# EAGLE design UIAPduino_Pro_Micro (EAGLE 9.6.2)
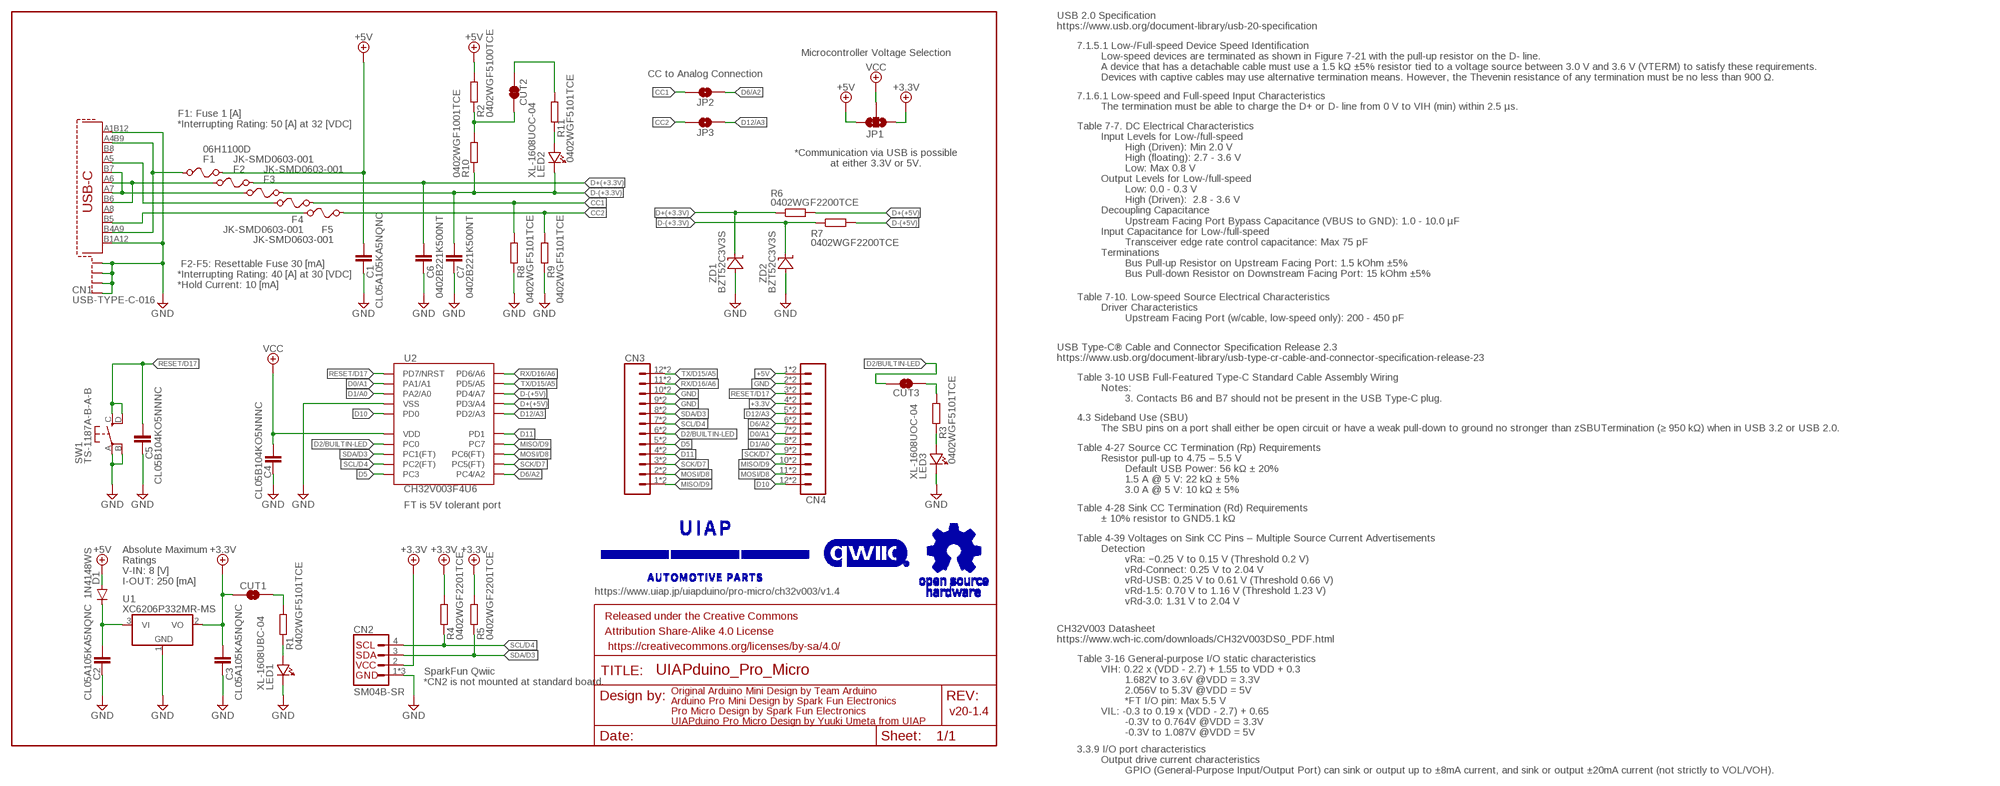
[diagram p0: schematic, sheet 1]

## Parts
C1  CL05A105KA5NQNC  C1005  [1005]
C2  CL05A105KA5NQNC  C1005  [1005]
C3  CL05A105KA5NQNC  C1005  [1005]
C4  CL05B104KO5NNNC  C1005  [1005]
C5  CL05B104KO5NNNC  C1005  [1005]
C6  0402B221K500NT  C1005  [1005]
C7  0402B221K500NT  C1005  [1005]
CN1  USB-TYPE-C-016  [USB-TYPE-C-016]
CN2  SM04B-SR  QWIIC_CONNECTORJS-1MM-GND  [JST04_1MM_RA]
CN3  CONN_12CASTLE_0.9MM  [1X12_CASTELLATED_0.9MM]
CN4  CONN_12CASTLE_0.9MM  [1X12_CASTELLATED_0.9MM]
CUT1  SMT-JP-2-NC  [SMT-JUMPER_2_NC_SILK_ROUND]
CUT2  SMT-JP-2-NC  [SMT-JUMPER_2_NC_SILK_ROUND]
CUT3  SMT-JP-2-NC  [SMT-JUMPER_2_NC_SILK_ROUND]
D1  1N4148WS  DIODE-SOD323-R  [SOD323-R]
F1  06H1100D  [1608]
F2  JK-SMD0603-001  06H1100D  [1608]
F3  JK-SMD0603-001  06H1100D  [1608]
F4  JK-SMD0603-001  06H1100D  [1608]
F5  JK-SMD0603-001  06H1100D  [1608]
FRAME1  FRAME-LETTER  [CREATIVE_COMMONS]
JP1  SMT-JP-3-NO-NC  [SMT-JUMPER_3_1-NC_TRACE_SILK]
JP2  SMT-JP-2-NO  [SMT-JUMPER_2_NO_SILK_ROUND]
JP3  SMT-JP-2-NO  [SMT-JUMPER_2_NO_SILK_ROUND]
LED1  XL-1608UBC-04  [1608-LED]
LED2  XL-1608UOC-04  [1608-LED]
LED3  XL-1608UOC-04  [1608-LED]
R1  0402WGF5101TCE  R1005  [1005]
R2  0402WGF5100TCE  R1005  [1005]
R3  0402WGF5101TCE  R1005  [1005]
R4  0402WGF2201TCE  R1005  [1005]
R5  0402WGF2201TCE  R1005  [1005]
R6  0402WGF2200TCE  R1005  [1005]
R7  0402WGF2200TCE  R1005  [1005]
R8  0402WGF5101TCE  R1005  [1005]
R9  0402WGF5101TCE  R1005  [1005]
R10  0402WGF1001TCE  R1005  [1005]
R11  0402WGF5101TCE  R1005  [1005]
SW1  TS-1187A-B-A-B  [TS-1187A-B-A-B]
U1  XC6206P332MR-MS  [SOT-23F_TOS]
U2  CH32V003F4U6  [QFN40P300X300X100-21T110]
ZD1  BZT52C3V3S  [SOD323-R]
ZD2  BZT52C3V3S  [SOD323-R]

## Nets
+3.3V [vcc]: C3.1 CN2.2 CN4.4 CN4.4B CUT1.2 JP1.1 R4.2 R5.2 U1.2(VO)
+5V [vcc]: C1.1 CN4.1 CN4.1B D1.A F1.2 JP1.3 R2.2
CC1: F4.2 JP2.1 R8.2
CC2: F5.2 JP3.1 R9.2
D0/A1: CN4.7 CN4.7B U2.2(PA1/A1)
D1/A0: CN4.8 CN4.8B U2.3(PA2/A0)
D2/BUILTIN-LED: CN3.6 CN3.6B CUT3.1 U2.7(PC0)
D5: CN3.5 CN3.5B U2.10(PC3)
D6/A2: CN4.6 CN4.6B JP2.2 U2.11(PC4/A2)
D10: CN4.12 CN4.12B U2.5(PD0)
D11: CN3.4 CN3.4B U2.15(PD1)
D12/A3: CN4.5 CN4.5B JP3.2 U2.16(PD2/A3)
D+(+3.3V): C6.1 F2.2 R6.1 ZD1.C
D+(+5V): R6.2 U2.17(PD3/A4)
D-(+3.3V): C7.1 F3.2 LED2.2(C) R7.1 R10.1 ZD2.C
D-(+5V): R7.2 U2.18(PD4/A7)
F1 [vcc]: CN1.A4B9(VBUS) CN1.B4A9(VBUS) F1.1
GND [GND]: C1.2 C2.2 C3.2 C4.2 C5.2 C6.2 C7.2 CN1.A1B12(GND) CN1.B1A12(GND) CN1.S1 CN1.S1B(S1) CN1.S2 CN1.S2B(S2) CN1.S3 CN1.S3B(S3) CN1.S4 CN1.S4B(S4) CN2.1 CN2.NC1 CN2.NC2 CN3.9 CN3.9B CN3.10 CN3.10B CN4.2 CN4.2B LED1.2(C) LED3.2(C) R8.1 R9.1 SW1.A(P) SW1.B(P1) U1.1(GND) U2.4(VSS) U2.21(VSS) ZD1.A ZD2.A
MISO/D9: CN3.1 CN3.1B CN4.10 CN4.10B U2.14(PC7)
MOSI/D8: CN3.2 CN3.2B CN4.11 CN4.11B U2.13(PC6(FT))
N$1: CN1.A6(DP1) CN1.B6(DP2) F2.1
N$2: CUT2.2 R2.1 R10.2
N$3: C2.1 D1.C U1.3(VI)
N$4: CN1.A7(DN1) CN1.B7(DN2) F3.1
N$5: CN1.A5(CC1) F4.1
N$6 [vcc]: CUT1.1 R1.2
N$7: LED3.1(A) R3.1
N$8: CN1.B5(CC2) F5.1
N$9: LED2.1(A) R11.1
N$10: CUT3.2 R3.2
N$11: CUT2.1 R11.2
N$38: LED1.1(A) R1.1
RESET/D17: C5.1 CN4.3 CN4.3B SW1.C(S) SW1.D(S1) U2.1(PD7/NRST)
RX/D16/A6: CN3.11 CN3.11B U2.20(PD6/A6)
SCK/D7: CN3.3 CN3.3B CN4.9 CN4.9B U2.12(PC5(FT))
SCL/D4: CN2.4 CN3.7 CN3.7B R4.1 U2.9(PC2(FT))
SDA/D3: CN2.3 CN3.8 CN3.8B R5.1 U2.8(PC1(FT))
TX/D15/A5: CN3.12 CN3.12B U2.19(PD5/A5)
VCC [vcc]: C4.1 JP1.2 U2.6(VDD)
Unconnected: CN1.A8(SBU1) CN1.B8(SBU2)

## Notes on the sheet
- USB 2.0 Specification
  https://www.usb.org/document-library/usb-20-specification
- 7.1.5.1 Low-/Full-speed Device Speed Identification
          Low-speed devices are terminated as shown in Figure 7-21 with the pull-up resistor on the D- line.
          A device that has a detachable cable must use a 1.5 kΩ ±5% resistor tied to a voltage source between 3.0 V and 3.6 V (VTERM) to satisfy these requirements.
          Devices with captive cables may use alternative termination means. However, the Thevenin resistance of any termination must be no less than 900 Ω.
- Microcontroller Voltage Selection
- CC to Analog Connection
- 7.1.6.1 Low-speed and Full-speed Input Characteristics
          The termination must be able to charge the D+ or D- line from 0 V to VIH (min) within 2.5 µs.
- Table 7-7. DC Electrical Characteristics
          Input Levels for Low-/full-speed
                  High (Driven): Min 2.0 V
                  High (floating): 2.7 - 3.6 V
                  Low: Max 0.8 V
          Output Levels for Low-/full-speed
                  Low: 0.0 - 0.3 V
                  High (Driven):  2.8 - 3.6 V
          Decoupling Capacitance
                  Upstream Facing Port Bypass Capacitance (VBUS to GND): 1.0 - 10.0 µF
          Input Capacitance for Low-/full-speed
                  Transceiver edge rate control capacitance: Max 75 pF
          Terminations
                  Bus Pull-up Resistor on Upstream Facing Port: 1.5 kOhm ±5%
                  Bus Pull-down Resistor on Downstream Facing Port: 15 kOhm ±5%
- F1: Fuse 1 [A]
  *Interrupting Rating: 50 [A] at 32 [VDC]
- *Communication via USB is possible
  at either 3.3V or 5V.
- F2-F5: Resettable Fuse 30 [mA]
  *Interrupting Rating: 40 [A] at 30 [VDC]
  *Hold Current: 10 [mA]
- Table 7-10. Low-speed Source Electrical Characteristics
          Driver Characteristics
                  Upstream Facing Port (w/cable, low-speed only): 200 - 450 pF
- USB Type-C® Cable and Connector Specification Release 2.3
  https://www.usb.org/document-library/usb-type-cr-cable-and-connector-specification-release-23
- Table 3-10 USB Full-Featured Type-C Standard Cable Assembly Wiring
          Notes:
                  3. Contacts B6 and B7 should not be present in the USB Type-C plug.
- 4.3 Sideband Use (SBU)
          The SBU pins on a port shall either be open circuit or have a weak pull-down to ground no stronger than zSBUTermination (≥ 950 kΩ) when in USB 3.2 or USB 2.0.
- Table 4-27 Source CC Termination (Rp) Requirements
          Resistor pull-up to 4.75 – 5.5 V
                  Default USB Power: 56 kΩ ± 20%
                  1.5 A @ 5 V: 22 kΩ ± 5%
                  3.0 A @ 5 V: 10 kΩ ± 5%
- Table 4-28 Sink CC Termination (Rd) Requirements
          ± 10% resistor to GND5.1 kΩ
- FT is 5V tolerant port
- Table 4-39 Voltages on Sink CC Pins – Multiple Source Current Advertisements
          Detection
                  vRa: −0.25 V to 0.15 V (Threshold 0.2 V)
                  vRd-Connect: 0.25 V to 2.04 V
                  vRd-USB: 0.25 V to 0.61 V (Threshold 0.66 V)
                  vRd-1.5: 0.70 V to 1.16 V (Threshold 1.23 V)
                  vRd-3.0: 1.31 V to 2.04 V
- Absolute Maximum
  Ratings
  V-IN: 8 [V]
  I-OUT: 250 [mA]
- https://www.uiap.jp/uiapduino/pro-micro/ch32v003/v1.4
- CH32V003 Datasheet
  https://www.wch-ic.com/downloads/CH32V003DS0_PDF.html
- Table 3-16 General-purpose I/O static characteristics
          VIH: 0.22 x (VDD - 2.7) + 1.55 to VDD + 0.3
                  1.682V to 3.6V @VDD = 3.3V
                  2.056V to 5.3V @VDD = 5V
                  *FT I/O pin: Max 5.5 V
          VIL: -0.3 to 0.19 x (VDD - 2.7) + 0.65
                  -0.3V to 0.764V @VDD = 3.3V
                  -0.3V to 1.087V @VDD = 5V
- SparkFun Qwiic
  *CN2 is not mounted at standard board.
- Original Arduino Mini Design by Team Arduino
- Arduino Pro Mini Design by Spark Fun Electronics
- Pro Micro Design by Spark Fun Electronics
- UIAPduino Pro Micro Design by Yuuki Umeta from UIAP | v20-1.4
- 3.3.9 I/O port characteristics
          Output drive current characteristics
                  GPIO (General-Purpose Input/Output Port) can sink or output up to ±8mA current, and sink or output ±20mA current (not strictly to VOL/VOH).

## Library data of the parts
C1-C7 = Mylib_e2:C
CN1 = Mylib_e2:USB-TYPE-C; JLCPCB-PART-#: C2927036; URL: https://jlcpcb.com/partdetail/DEALON-USB_TYPE_C016/C2927036
CN2 = SparkFun-Connectors:QWIIC_CONNECTOR: SparkFun I2C Standard Qwiic Connector An SMD 1mm pitch JST connector makes it easy and quick (get it? Qwiic?) to connect I2C devices to each other. The Qwiic system <http://www.sparkfun.com/qwiic> enables fast and solderless connection between popular platforms and various sensors and actuators. We carry 200mm <https://www.sparkfun.com/products/14204>, 100mm <https://www.sparkfun.com/products/14205>, 50mm <https://www.sparkfun.com/products/14206>, and breadboard friendly <https://www.sparkfun.com/products/14207> Qwiic cables. We also offer 10 pcs strips <https://www.sparkfun.com/products/14323> the SMD connectors.; PROD_ID: CONN-13694; VALUE: QWIIC_RIGHT_ANGLE
CN3 CN4 = Castellated:CONN_12: Multi connection point. Often used as Generic Header-pin footprint for 0.1 inch spaced/style header connections On any of the 0.1 inch spaced packages, you can populate with these: Break Away Headers - Straight <https://www.sparkfun.com/products/116> (PRT-00116) Break Away Male Headers - Right Angle <https://www.sparkfun.com/products/553> (PRT-00553) Female Headers <https://www.sparkfun.com/products/115> (PRT-00115) Break Away Headers - Machine Pin <https://www.sparkfun.com/products/117> (PRT-00117) Break Away Female Headers - Swiss Machine Pin <https://www.sparkfun.com/products/743> (PRT-00743) For SCREWTERMINALS and SPRING TERMINALS visit here: Screw Terimnals on SparkFun.com <https://www.sparkfun.com/search/results?term=Screw+Terminals> (5mm/3.5mm/2.54mm spacing) This device is also useful as a general connection point to wire up your design to another part of your project. Our various solder wires solder well into these plated through hole pads. Hook-Up Wire - Assortment (Stranded, 22 AWG) <https://www.sparkfun.com/products/11375> (PRT-11375) Hook-Up Wire - Assortment (Solid Core, 22 AWG) <https://www.sparkfun.com/products/11367> (PRT-11367) View the entire wire category on our website here <https://www.sparkfun.com/categories/141> Special notes: Molex polarized connector foot print use with SKU : PRT-08231 with associated crimp pins and housings. 1MM SMD Version SKU: PRT-10208 NOTES ON THE VARIANTS LOCK and LOCK_LONGPADS... This footprint was designed to help hold the alignment of a through-hole component (i.e. 6-pin header) while soldering it into place. You may notice that each hole has been shifted either up or down by 0.005 of an inch from it's more standard position (which is a perfectly straight line). This slight alteration caused the pins (the squares in the middle) to touch the edges of the holes. Because they are alternating, it causes a "brace" to hold the component in place. 0.005 has proven to be the perfect amount of "off-center" position when using our standard breakaway headers. Although looks a little odd when you look at the bare footprint, once you have a header in there, the alteration is very hard to notice. Also,if you push a header all the way into place, it is covered up entirely on the bottom side.
CUT1-CUT3 = Mylib_e2:SMT-JP-2-NC
D1 = diode:DIODE-: DIODE; JLCPCB-PART-#: C2128; URL: https://jlcpcb.com/partdetail/2485-1N4148WS/C2128
F1-F5 = Mylib_e2:06H1100D; JLCPCB-PART-#: C182303; URL: https://jlcpcb.com/partdetail/Shenzhen_lansonElec-06H1100D/C182303
FRAME1 = SparkFun-Aesthetics:FRAME-LETTER: Schematic Frame - Letter Standard 8.5x11 US Letter frame
JP1 = Mylib_e2:SMT-JP-3-NO-NC
JP2 JP3 = Mylib_e2:SMT-JP-2-NO
LED1 = Mylib_e2:XL-1608UBC-04; JLCPCB-PART-#: C965807; URL: https://jlcpcb.com/partdetail/C965807
LED2 LED3 = Mylib_e2:XL-1608UOC-04; JLCPCB-PART-#: C965801; URL: https://jlcpcb.com/partdetail/C965801
R1-R11 = Mylib_e2:R
SW1 = Mylib_e2:TS-1187A-B-A-B; JLCPCB-PART-#: C318884; URL: https://jlcpcb.com/partdetail/XKBConnection-TS_1187A_B_AB/C318884
U1 = Mylib_e2:XC6206P332MR-MS; JLCPCB-PART-#: C5252899; URL: https://jlcpcb.com/partdetail/C5252899
U2 = Mylib_e2:CH32V003F4U6: https://www.wch-ic.com/downloads/file/358.html
ZD1 ZD2 = Mylib_e2:BZT52C3V3S; JLCPCB-PART-#: C5190164; URL: https://jlcpcb.com/partdetail/GuangdongHottech-BZT52C3V3S/C5190164

## Net classes
0 default: width 0.203 mm
1 vcc: width 0.305 mm
2 GND: width 0.508 mm

## Board
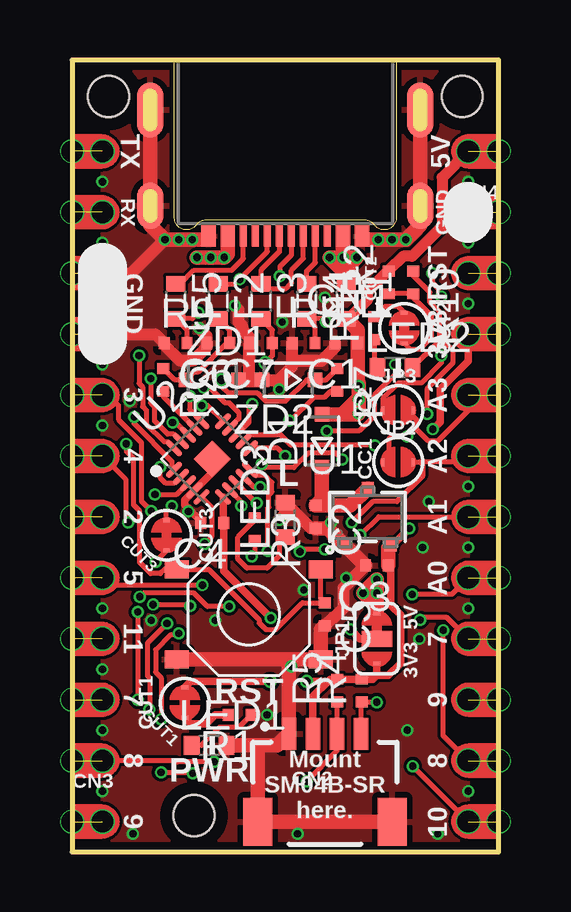
[diagram p1: board, top side]
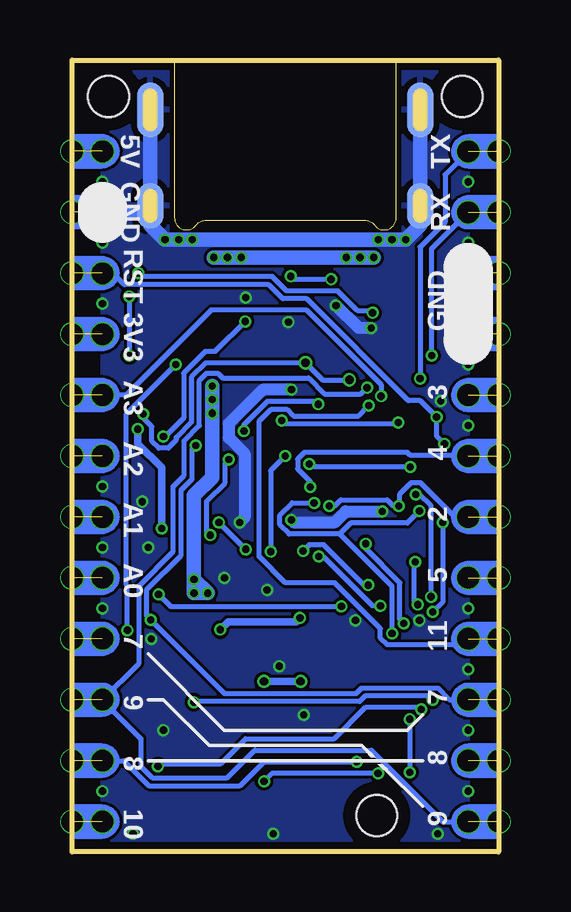
[diagram p2: board, bottom side, seen from below]

Size 17.78 x 33.02 mm. Coordinates in mm from the lower left corner, seen from the top.
Outline: 0,33.02 0,0 17.78,0 17.78,33.02 0,33.02
Copper layers (1*16): Top 0.035mm / dielectric 1.5mm / Bottom 0.035mm
Design rules "SparkFun-2-layer-FAB-LIMIT *": minimum track width 5mil, minimum drill 0.3mm, track to track 5mil, track to pad 5mil, pad to pad 5mil, via to via 5mil, smd to smd 4mil, copper to edge 0.3mm, drill to drill 0.5mil, minimum pad ring 0.05mm, minimum via ring 0.1mm, stop-mask expansion 2mil, vias tented up to drill 25mil, thermal gap 10mil
Holes 1.7 mm at 1.52,31.5 16.26,31.5 5.08,1.52
tRestrict: area 0.1,30.1 to 2.9,32.9; area 14.9,30.1 to 17.7,32.9; area 3.7,0.1 to 6.5,2.9; area -2.5,0 to 0,33; area 17.8,0 to 20.3,33
bRestrict: area 0.1,30.1 to 2.9,32.9; area 14.9,30.1 to 17.7,32.9; area 3.7,0.1 to 6.5,2.9; area -2.5,0 to 0,33; area 17.8,0 to 20.3,33

### Footprints (pad centres in the part's own frame; a part is rotated, then mirrored left to right if it is on the bottom)
1005 = smd 0.45 x 0.5: 1 -0.475,0; 2 0.475,0
USB-TYPE-C-016 = smd 0.6 x 0.9: A1B12 -3.2,2.685; A4B9 -2.4,2.685; B1A12 3.2,2.685; B4A9 2.4,2.685 | smd 0.3 x 0.9: A5 -1.25,2.685; A6 -0.25,2.685; A7 0.25,2.685; A8 1.25,2.685; B5 1.75,2.685; B6 0.75,2.685; B7 -0.75,2.685; B8 -1.75,2.685 | smd 1.1 x 1.9: S1 -5.62,1.435; S2 5.62,1.435 | smd 1.1 x 1.9 bottom: S1B -5.62,1.435; S2B 5.62,1.435 | smd 1.1 x 2.3: S3 -5.62,-2.565; S4 5.62,-2.565 | smd 1.1 x 2.3 bottom: S3B -5.62,-2.565; S4B 5.62,-2.565
JST04_1MM_RA = smd 0.6 x 1.35: 1 -1.5,0; 2 -0.5,0; 3 0.5,0; 4 1.5,0 | smd 1.2 x 2: NC1 2.8,-3.675; NC2 -2.8,-3.675
1X12_CASTELLATED_0.9MM = drill 0.9 pad 1.016: 1 0,0; 2 0,2.54; 3 0,5.08; 4 0,7.62; 5 0,10.16; 6 0,12.7; 7 0,15.24; 8 0,17.78; 9 0,20.32; 10 0,22.86; 11 0,25.4; 12 0,27.94 | drill 0.9 pad 0.95: 1B -1.27,0; 2B -1.27,2.54; 3B -1.27,5.08; 4B -1.27,7.62; 5B -1.27,10.16; 6B -1.27,12.7; 7B -1.27,15.24; 8B -1.27,17.78; 9B -1.27,20.32; 10B -1.27,22.86; 11B -1.27,25.4; 12B -1.27,27.94
SMT-JUMPER_2_NC_SILK_ROUND = smd 0.152 x 0.305: 1 -0.635,0; 2 0.635,0
SOD323-R = smd 0.6 x 0.6: A 1.1,0; C -1.1,0
1608 = smd 0.8 x 0.65: 1 0,-0.725; 2 0,0.725
SMT-JUMPER_3_1-NC_TRACE_SILK = smd 0.152 x 0.305: 1 -1.041,0; 3 1.041,0 | smd 0.66 x 1.27: 2 0,0
SMT-JUMPER_2_NO_SILK_ROUND = smd 0.152 x 0.305: 1 -0.635,0; 2 0.635,0
1608-LED = smd 0.8 x 0.65: 1 0,-0.725; 2 0,0.725
TS-1187A-B-A-B = smd 1 x 0.75: A -3,1.875; B 3,1.875; C -3,-1.875; D 3,-1.875
SOT-23F_TOS = smd 0.508 x 0.508: 1 -0.95,-1.194; 2 0.95,-1.194; 3 0,1.194
QFN40P300X300X100-21T110 = smd 0.837 x 0.22: 1 -1.437,0.8; 2 -1.437,0.4; 3 -1.437,0; 4 -1.437,-0.4; 5 -1.437,-0.8; 11 1.437,-0.8; 12 1.437,-0.4; 13 1.437,0; 14 1.437,0.4; 15 1.437,0.8 | smd 0.22 x 0.837: 6 -0.8,-1.437; 7 -0.4,-1.437; 8 0,-1.437; 9 0.4,-1.437; 10 0.8,-1.437; 16 0.8,1.437; 17 0.4,1.437; 18 0,1.437; 19 -0.4,1.437; 20 -0.8,1.437 | smd 1.1 x 1.1: 21 0,0

### Placement (x,y rotation side)
C1  11.43,21.21 180 top
C2  10.16,13.97 270 top
C3  12.7,11.94 180 top
C4  5.84,13.72 180 top
C5  10.54,9.91 270 top
C6  6.1,21.21 180 top
C7  7.87,21.21 180 top
CN1  8.89,28.37 180 top
CN2  10.54,4.93 0 top
CN3  1.27,1.27 0 top
CN4  16.51,29.21 180 top
CUT1  4.7,6.22 90 top
CUT2  13.84,21.84 270 top
CUT3  3.94,13.21 270 top
D1  10.41,17.14 90 top
F1  11.43,22.96 180 top
F2  6.1,22.96 180 top
F3  7.87,22.96 180 top
F4  9.78,22.96 180 top
F5  4.32,22.96 180 top
FRAME1  -20.32,-12.7 0 top  (outside the outline)
JP1  12.7,8.89 90 top
JP2  13.59,16.26 0 top
JP3  13.59,18.41 0 top
LED1  5.71,4.45 270 top
LED2  13.46,20.19 270 top
LED3  8.89,13.84 0 top
R1  6.99,5.71 180 top
R2  13.21,23.75 90 top
R3  7.62,13.46 270 top
R4  12.06,6.73 90 top
R5  11.05,6.73 90 top
R6  3.81,19.68 270 top
R7  11.05,19.68 270 top
R8  9.65,21.21 0 top
R9  4.32,21.21 0 top
R10  14.22,23.75 270 top
R11  12.6,21.84 90 top
SW1  7.37,9.91 180 top
U1  12.32,13.97 0 top
U2  5.84,16.38 45 top
ZD1  5.84,19.68 0 top
ZD2  9.02,19.68 180 top

### Tracks (layer width: path | path; a pad name or v marks a point on that pad's centre or on a via)
+3.3V  (via drill 0.3, 0.35)  (1 unrouted)
  Top 0.305: CN2.2 10.04,6.49 10.67,7.11 | 10.67,7.11 10.76,7.21 R5.2 R4.2 12.54,7.21 12.7,7.37 | JP1.1 12.7,7.37 | CUT1.2 4.95,7.11 v8.26,7.11 | v9.78,7.11 10.67,7.11 | CN4.4 16.51,20.47 15.34,19.3 15.34,17.93 v15.04,17.63 | v14.05,13.49 13.34,12.78 U1.2 | C3.1 13.28,11.83 13.28,10.29 13.69,9.88 13.69,7.87 13.18,7.37 12.7,7.37
  Top 0.61: U1.2 13.18,12.68 C3.1
  Bottom 0.305: v8.26,7.11 v9.78,7.11 | v15.04,17.63 15.04,17.02 14.05,16.03 v14.05,13.49
+5V  (via drill 0.3 pad 0.5)  (1 unrouted)
  Top 0.305: R2.2 13.21,24.26
  Top 0.457: CN4.1 15.42,28.12 15.42,26.09 14.17,24.84 13.79,24.84 13.21,24.26 12.32,23.37 12.32,23.02 11.53,22.24 F1.2
  Top 0.61: D1.A 11.26,18.25 | 11.26,18.25 11.94,18.92 v11.94,19.43 v11.94,18.86 v11.94,18.29 | v12.7,11.37 v12.7,11.36 | v12.7,11.36 v12.7,10.79 | v11.94,18.29 11.89,18.25 11.26,18.25 | v11.94,18.29 11.94,19.56 11.9,19.59 C1.1 11.9,21.76 F1.2 | v12.7,10.79 JP1.3 12.7,10.22 v12.13,10.79 | v12.13,10.79 12.62,11.28 v12.7,11.36 | v12.13,10.79 v12.7,10.79
  Bottom 0.61: v12.7,11.37 12.7,14.86 11.94,15.62 v11.94,18.29 v11.94,18.86 v11.94,19.43 | v12.7,11.37 v12.7,10.79 v12.13,10.79 v12.7,11.37
CC1  (via drill 0.3)
  Top 0.203: R8.2 10.13,21.89 F4.2 10.45,22.24 v10.57,22.12 | JP2.1 13.21,16.51 13.21,17.22 13.31,17.32 v13.97,17.32
  Bottom 0.203: v13.97,17.32 13.89,17.32 13.13,18.09 13.13,19.96 12.22,20.88 11.81,20.88 v10.57,22.12
CC2  (via drill 0.3)
  Top 0.203: R9.2 4.79,21.76 F5.2 5.01,22.24 v5.26,22.48 | JP3.1 12.95,18.9 13.61,19.56 14.55,19.56 15.39,20.4 v15.39,20.7 | v15.01,24.13 15.01,23.75 15.27,23.5 15.27,23.29 v15.39,23.16
  Bottom 0.203: v15.01,24.13 14.88,24 9.45,24 8.84,23.39 6.71,23.39 5.89,22.58 5.36,22.58 v5.26,22.48 | v15.39,23.16 v15.39,20.7
D0/A1  (via drill 0.3)  (1 unrouted)
  Top 0.203: v7.9,16.18 8.05,16.03 9.25,16.03 9.86,16.64 10.97,16.64 v11.25,16.36 | CN4.7 12.78,13.97 v12.01,13.21 | U2.2 4.26,15.37 3.91,15.37 3.68,15.59 v3.68,16.05
  Bottom 0.203: v3.68,16.05 3.71,16.08 7.8,16.08 v7.9,16.18 | v11.25,16.36 11.4,16.2 11.4,15.39 12.17,14.63 12.17,13.36 v12.01,13.21
D1/A0  (via drill 0.3)  (1 unrouted)
  Top 0.203: U2.3 4.37,14.91 v3.45,14.91 | v2.82,10.64 2.97,10.79 5.08,10.79 5.64,10.24 v6.55,10.24 | v14.17,10.74 15.82,10.74 CN4.8
  Bottom 0.203: v3.45,14.91 3.3,14.91 2.82,14.43 v2.82,10.64 | v14.17,10.74 13.66,10.24 v6.55,10.24
D2/BUILTIN-LED  (via drill 0.3)  (1 unrouted)
  Top 0.203: CUT3.1 3.94,14.2 v4.17,14.43 | U2.7 7.06,14.6 v7.06,14.43
  Bottom 0.203: v7.06,14.43 6.83,14.43 6.58,14.68 4.65,14.68 4.39,14.43 v4.17,14.43 4.12,14.48 4.12,14.94 3.66,15.39 3.25,15.39 1.83,13.97 CN3.6
D5  (via drill 0.3)  (1 unrouted)
  Top 0.203: v8.15,12.55 8.15,14.33 8.2,14.38 8.2,14.88 8.33,15.01 8.33,15.41 8.05,15.69 7.66,15.69 U2.10 | v5.44,11.12 1.57,11.12 CN3.5
  Bottom 0.203: v8.15,12.55 7.9,12.8 7.29,12.8 5.61,11.12 v5.44,11.12
D6/A2  (via drill 0.3)  (1 unrouted)
  Top 0.203: v10.54,12.62 9.6,12.62 v9.5,12.52 | v11.66,13.74 12.52,14.61 13.54,14.61 14.61,15.67 14.61,16.13 14.48,16.26 | JP2.2 14.48,16.26 | CN4.6 16.26,16.26 14.48,16.26 | v8.89,16.51 8.57,16.83 U2.11
  Bottom 0.203: v11.66,13.74 v10.54,12.62 | v8.89,16.51 9.5,15.9 v9.5,12.52
D10  (via drill 0.3)  (1 unrouted)
  Top 0.203: v3.96,9.53 3.15,8.71 3.15,7.34 3.25,7.24 3.25,5.97 v3.23,5.94 | CN4.12 v14.2,3.58 | v5.54,12.85 5.84,13.16 5.84,14.35 U2.5
  Bottom 0.203: v5.54,12.85 5.54,12.65 4.12,11.23 4.12,9.68 v3.96,9.53 | v3.23,5.94 3.33,6.04 5.54,6.04 6.86,4.72 10.54,4.72 11.58,3.68 14.1,3.68 v14.2,3.58
D11  (via drill 0.3)  (1 unrouted)
  Top 0.203: U2.15 5.64,18.62 v5.41,18.62
  Bottom 0.203: v5.41,18.62 5.84,18.19 8.56,18.19 8.84,18.47 9.47,18.47 9.98,17.96 9.98,12.32 8.89,11.23 6.83,11.23 4.93,9.32 4.93,8.91 4.65,8.64 1.52,8.64 CN3.4
D12/A3  (via drill 0.3)  (1 unrouted)
  Top 0.203: JP3.2 14.22,18.16 14.35,18.03 14.35,17.63 14.83,17.14 15.24,17.14 16.51,18.41 CN4.5 | U2.16 5.22,18.14 5.21,18.14 4.9,18.45 v4.9,19
  Bottom 0.203: v4.9,19 4.9,19.48 8.03,22.61 11.96,22.61 15.52,19.05 CN4.5
D+(+3.3V)
  Top 0.203: F2.2 6.57,21.76 C6.1 6.45,21.21 5.25,20.02 5.07,20.02 ZD1.C 4.29,19.68 R6.1
D+(+5V)
  Top 0.203: R6.2 3.81,18.98 U2.17
D-(+3.3V)  (via drill 0.3, 0.35)
  Top 0.203: F3.2 8.35,21.76 C7.1 8.35,20.69 v8.05,20.39 | R7.1 10.57,19.68 ZD2.C 9.78,19.68 8.89,18.8 8.07,18.8 7.72,19.15 6.51,19.15 6.22,19.43 v6.22,19.68 | R10.1 14.22,24.03 14.91,23.34 14.91,22.91 15.32,22.5 15.32,21.32 15.25,21.26 | v14.81,18.26 14.81,19.33 15.88,20.4 15.88,20.9 15.52,21.26 15.25,21.26 | LED2.2 15.25,21.26
  Bottom 0.203: v6.22,19.68 7.34,19.68 v8.05,20.39 12.21,20.39 12.8,19.8 12.8,17.92 13.44,17.28 13.44,17.17 13.77,16.84 14.17,16.84 14.45,17.12 14.45,17.73 14.81,18.09 v14.81,18.26
D-(+5V)  (via drill 0.3)
  Top 0.203: v9.04,17.98 9.12,17.98 10.11,18.97 10.54,18.97 10.77,19.2 R7.2 | v4.19,17.91 4.32,17.91 U2.18
  Bottom 0.203: v9.04,17.98 8.91,17.86 4.24,17.86 v4.19,17.91
F1  (via drill 0.3 pad 0.5)
  Top 0.61: v5.21,24.79 v5.78,24.79 v6.35,24.79 6.49,24.93 CN1.B4A9 | v11.3,24.79 v10.73,24.79 11.43,24.09 F1.1 | v11.3,24.79 v11.87,24.79 11.43,24.35 F1.1 | CN1.A4B9 11.29,24.8 v11.3,24.79 | v11.3,24.79 11.43,24.66 F1.1
  Bottom 0.61: v5.21,24.79 v5.78,24.79 v6.35,24.79 v10.73,24.79 v11.3,24.79 v11.87,24.79
GND  (via drill 0.3, 0.3 pad 0.5)  (3 unrouted)
  Top 0.305: U2.21 5.84,15.82 U2.4 4.7,14.67 4.7,14.48 4.92,14.26 | C4.2 5.37,13.81 4.92,14.26 | v4.85,14.2 4.92,14.26
  Top 0.406: C4.2 5.36,13.71
  Top 0.508: 7.39,19.68 C7.2 | C7.2 | 9.17,20.47 9.17,20.24 8.61,19.68 | 9.17,20.47 R8.1 | ZD2.A 8.61,19.68 | 9.17,20.47 10.39,20.47 10.96,21.04 C1.2 | v6.78,22.78 6.78,22.76 6.93,22.61 6.93,22.1 7.09,21.94 7.09,21.75 7.39,21.45 C7.2 | v5.31,21.84 5.31,21.82 5.61,21.51 C6.2 5.61,21.06 5.05,20.5 4.49,20.5 3.84,21.14 R9.1 3.46,21.59 CN3.9 | 8.64,19.46 v8.64,19.28 8.64,19.66 8.61,19.68 | C3.2 11.3,11.02 11.3,10.16 10.92,9.78 10.88,9.78 C5.2 | v8.64,13.84 8.89,14.1 LED3.2 9.96,13.49 C2.2 | v10.79,13.74 10.65,13.6 10.65,13.49 | CN3.10 2.48,24.13 v3.87,25.53
  Top 0.61: CN1.S4B CN1.S2B 3.27,26.13 v3.87,25.53 v4.45,25.53 v5.02,25.53 5.53,25.53 CN1.B1A12 | CN1.S3 CN1.S1 14.51,26.13 v13.91,25.53 v13.34,25.53 v12.76,25.53 12.25,25.53 CN1.A1B12 | C2.2 10.65,13.49 U1.1 11.39,12.78 C3.2 | CN2.NC1 CN2.NC2 7.74,4.44 7.75,4.45 | CN3.9 CN3.10 | SW1.B 9.02,8.03 | 9.02,8.03 SW1.A 10.37,9.26 C5.2 | LED1.2 7.75,4.45 | 7.75,4.45 8.56,4.45 CN2.1 9.04,8.01 9.02,8.03 | ZD1.A 7.39,19.68 ZD2.A
  Bottom 0.508: v4.85,14.2 6.38,14.2 6.83,13.74 8.53,13.74 v8.64,13.84 | v6.78,22.78 5.84,21.84 v5.31,21.84 | v10.79,13.74 10.59,13.95 10.59,16.61 11.25,17.27 11.25,17.86 9.83,19.28 v8.64,19.28
  Bottom 0.61: CN1.S4B CN1.S2B 3.27,26.13 v3.87,25.53 v4.45,25.53 v5.02,25.53 v12.76,25.53 v13.34,25.53 v13.91,25.53 14.51,26.13 CN1.S1 | CN1.S3 CN1.S1 | CN4.2 14.78,26.67 CN1.S1 | CN3.10 CN3.9
  other vias: 1.27,27.94 1.27,25.4 1.27,20.32 16.51,27.94 1.27,17.78 16.51,25.4 2.41,18.8 16.51,22.86 14.48,8.89 16.51,15.24 14.86,14.61 14.61,12.7 16.51,12.7 9.65,10.92 16.51,10.16 11.43,11.43 3.3,9.65 9.14,7.75 5.97,9.65 1.27,7.62 8.13,5.71 15.24,0.76 9.4,0.76 1.27,10.16 13.97,5.08 2.54,0.76 1.27,2.54 1.27,5.08 16.51,2.54 8.76,22.1 10.54,23.11
  pour Top (rank 6): 1.27,0 1.27,33.02 16.51,33.02 16.51,0
  pour Bottom (rank 6): 1.27,0 1.27,33.02 16.51,33.02 16.51,0
  cutout Top: 3.81,16.51 5.71,18.41 arc-90 5.97,18.41 7.87,16.51 arc-90 7.87,16.26 5.97,14.35 arc-90 5.71,14.35 3.81,16.26 arc-90
  cutout Top: 11.86,8.34 11.86,9.44 arc-90 12.7,10.28 arc-90 13.54,9.44 13.54,8.34 arc-90 12.7,7.5 arc-90
  cutout Top: 4.19,33.02 13.59,33.02 arc-90 13.72,32.89 13.72,25.91 arc-90 13.59,25.78 4.19,25.78 arc-90 4.06,25.91 4.06,32.89 arc-90
  cutout Bottom: 4.19,33.02 13.59,33.02 arc-90 13.72,32.89 13.72,25.91 arc-90 13.59,25.78 4.19,25.78 arc-90 4.06,25.91 4.06,32.89 arc-90
  cutout Top: 12.83,21.84 arc-90 13.84,22.86 arc-90 14.86,21.84 arc-90 13.84,20.83 arc-90
  cutout Top: 12.57,18.41 arc-90 13.59,19.43 arc-90 14.61,18.41 arc-90 13.59,17.4 arc-90
  cutout Top: 12.57,16.26 arc-90 13.59,17.27 arc-90 14.61,16.26 arc-90 13.59,15.24 arc-90
  cutout Top: 3.68,6.22 arc-90 4.7,7.24 arc-90 5.71,6.22 arc-90 4.7,5.21 arc-90
  cutout Top: 2.92,13.21 arc-90 3.94,14.22 arc-90 4.95,13.21 arc-90 3.94,12.19 arc-90
MISO/D9  (via drill 0.3)  (2 unrouted)
  Top 0.203: U2.14 6.96,18.06 6.96,18.32 6.55,18.72 6.38,18.72 5.74,19.36 v5.49,19.36
  Bottom 0.203: v5.49,19.36 5.74,19.1 7.26,19.1 7.92,19.76 11.51,19.76 11.71,19.96 12.17,19.96 12.47,19.66 12.47,17.78 13.11,17.14 13.11,15.7 13.56,15.24 13.56,12.52 14.99,11.1 14.99,7.87 CN4.10 16.51,6.33 14.91,4.72 14.91,3.58 14.43,3.1 11.3,3.1 10.16,4.24 5.31,4.24 2.34,1.27 CN3.1
MOSI/D8  (via drill 0.3)  (2 unrouted)
  Top 0.203: U2.13 7.37,17.91 7.37,18.52 v7.52,18.67 | v15.47,9.25 15.47,4.85 CN4.11 | CN3.2 4.34,3.81 4.39,3.76 v5.92,3.76 | v10.62,17.55 11.96,17.55 12.6,18.19 12.6,19.05 13.46,19.91 v13.46,20.32
  Bottom 0.203: v7.52,18.67 7.64,18.8 9.63,18.8 10.62,17.8 v10.62,17.55 | v5.92,3.76 9.78,3.76 10.77,2.77 14.58,2.77 15.62,3.81 CN4.11 | v13.46,20.32 15.52,18.26 15.52,11.12 15.47,11.07 v15.47,9.25
N$1  (via drill 0.3 pad 0.5)
  Top 0.203: CN1.A6 9.14,24.89 8.66,24.41 v8.66,24 | CN1.B6 8.14,25.03 v6.99,23.88 6.8,23.69 F2.1
  Bottom 0.203: v8.66,24 8.53,23.88 v6.99,23.88
N$2
  Top 0.203: R2.1 R10.2 14.22,23.11 14.99,22.35 14.99,21.46 14.48,20.95 14.1,20.95 CUT2.2
N$3
  Top 0.61: D1.C 10.41,14.7 C2.1 11.6,14.45 U1.3
N$4
  Top 0.203: CN1.A7 8.64,25.02 7.87,24.26 F3.1 7.9,23.69 8.09,23.5 8.92,23.5 9.14,23.72 9.14,24.26 9.64,24.75 CN1.B7
N$5
  Top 0.203: F4.1 9.78,24.22 10.14,24.58 CN1.A5
N$6
  Top 0.305: CUT1.1 4.95,5.33 5.59,5.33 5.97,5.71 R1.2
N$7
  Top 0.203: R3.1 7.62,13.84 6.91,13.13 6.91,12.22 7.29,11.84 8.13,11.84 8.64,12.34 8.64,13.11 8.89,13.11 LED3.1
N$8
  Top 0.203: CN1.B5 7.14,24.75 6.65,24.26 5.08,24.26 4.51,23.69 F5.1
N$9
  Top 0.203: R11.1 12.6,20.33 LED2.1
N$10  (via drill 0.3)
  Top 0.203: v3.48,12.09 3.64,12.25 3.94,12.55 CUT3.2 | R3.2 7.62,12.45 v7.49,12.32 | v3.38,10.31 4.88,10.31 v4.93,10.26
  Bottom 0.203: v4.93,10.26 5.26,10.26 7.32,12.32 v7.49,12.32 | v3.38,10.31 3.53,10.46 3.53,12.04 v3.48,12.09
N$11
  Top 0.203: R11.2 13.01,22.73 13.59,22.73 CUT2.1
N$38
  Top 0.203: R1.1 6.95,5.2 6.15,5.2 5.39,4.45 LED1.1
RESET/D17  (via drill 0.3)  (1 unrouted)
  Top 0.203: SW1.C 10.37,10.56 C5.1 9.6,10.39 8.48,9.27 8.08,9.27 7.8,9.55 7.8,9.68 5.69,11.78 SW1.D 3.86,11.78 3.68,11.61 3.28,11.61 2.82,12.06 2.82,14.22 2.56,14.48 2.56,16.41 2.26,16.71 v2.26,17.02 | U2.1 4.16,16.03 4.16,16.29 2.59,17.86 v2.59,18.14
  Bottom 0.203: v2.26,17.02 2.59,17.35 v2.59,18.14 3.28,18.82 3.76,18.82 8,23.06 8.99,23.06 9.58,23.65 15.6,23.65 16.08,24.13 CN4.3
RX/D16/A6  (via drill 0.3)  (1 unrouted)
  Top 0.203: v2.79,20.7 2.79,19.53 2.95,19.38 2.95,18.57 3.1,18.41 3.1,17.83 3.83,17.09 4,17.09 U2.20
  Bottom 0.203: v2.79,20.7 2.79,25.15 CN3.11
SCK/D7  (via drill 0.3)  (2 unrouted)
  Top 0.203: v12.62,16.94 12.6,16.97 9.12,16.97 8.69,17.4 7.42,17.4 U2.12 | v14.5,9.68 14.61,9.78 15.62,9.78 CN4.9
  Bottom 0.203: v12.62,16.94 12.78,16.79 12.78,15.54 13.23,15.09 13.23,12.37 14.66,10.95 14.66,9.83 v14.5,9.68 11.43,6.6 5.94,6.6 5.71,6.83 2.54,6.83 2.06,6.35 CN3.3
SCL/D4  (via drill 0.3)  (1 unrouted)
  Top 0.203: CN2.4 12.04,6.23 R4.1 12.07,6.25 v12.7,6.25 | v2.74,10.01 v2.74,6.35 | v2.34,13.74 2.23,13.84 2.23,15.54 CN3.7 | U2.9 7.58,15.21 v7.85,15.21
  Bottom 0.203: v7.85,15.21 7.85,15.44 8.38,15.98 8.38,16.38 8.1,16.66 3.81,16.66 3.68,16.54 1.29,16.54 CN3.7 | v12.7,6.25 12.68,6.27 5.79,6.27 5.56,6.5 2.9,6.5 v2.74,6.35 | v2.74,10.01 2.34,10.41 v2.34,13.74
SDA/D3  (via drill 0.3)  (1 unrouted)
  Top 0.203: R5.1 11.04,6.25 CN2.3 11.04,4.21 v9.78,2.95 | v3.3,14.22 2.9,14.63 2.9,17.07 1.93,18.03 1.93,18.62 1.5,19.05 CN3.8 | v5.03,3.28 5,3.3 3.73,3.3 v3.71,3.33 | v3.71,5.54 3.71,7.26 3.48,7.49 3.48,8.43 4.09,9.04 4.37,9.04 v4.45,9.12 | U2.8 7.67,14.55 v7.7,14.55
  Bottom 0.203: v7.7,14.55 8.61,14.55 9.12,14.05 9.12,13.64 8.74,13.26 6.63,13.26 | 6.63,13.26 6.17,13.72 3.81,13.72 v3.3,14.22 | v9.78,2.95 9.45,3.28 v5.03,3.28 | v3.71,5.54 v3.71,3.33 | 6.63,13.26 4.45,11.07 v4.45,9.12
TX/D15/A5  (via drill 0.3)  (1 unrouted)
  Top 0.203: v3.28,19.74 3.28,18.72 3.43,18.57 3.43,17.98 3.99,17.42 4.24,17.42 U2.19
  Bottom 0.203: v3.28,19.74 3.28,25.22 2.23,26.26 2.23,28.25 CN3.12
VCC  (via drill 0.3)
  Top 0.305: v11.61,9.27 11.99,8.89 JP1.2 | v8.28,9.75 6.32,11.72 C4.1 6.29,13.74 U2.6
  Bottom 0.305: v8.28,9.75 8.43,9.6 11.28,9.6 v11.61,9.27

### Text on the board
tPlace: TX | 5V | RX | GND | RST | GND | CUT2 | 3V3 | 3 | CC2 | A3 | 4 | A2 | L | CC1 | 2 | A1 | CUT3 | 5 | A0 | 5V | 11 | 7 | 3V3 | RST | 7 | 9 | CUT1 | 8 | 8 | PWR | Mount / SM04B-SR / here. | 9 | 10
bPlace: TX | 5V | RX | GND | RST | GND | 3V3 | 3 | A3 | 4 | A2 | 2 | A1 | 5 | A0 | 11 | 7 | 7 | 9 | 8 | 8 | 9 | 10
Measures: Units in Inches
tDocu: Yuuki Umeta from UIAP